# Altium schematic sheet LightSensorsButtons.SchDoc
size A
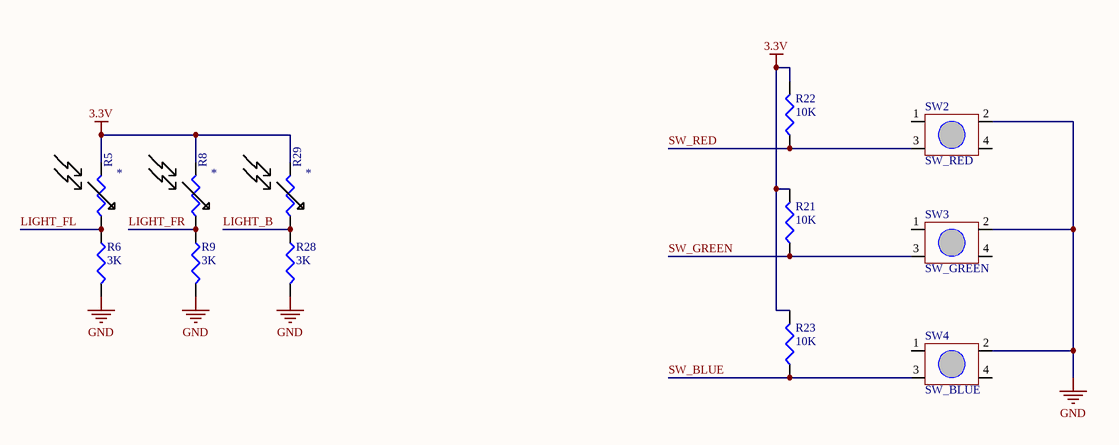
[diagram p0: LightSensorsButtons.SchDoc]

## Parts
R5  photoresistor  [photoresistor]  (value not drawn)
R6  value 3K  [RESC1608L]  (hidden comment: Res3)
R8  photoresistor  [photoresistor]  (value not drawn)
R9  value 3K  [RESC1608L]  (hidden comment: Res3)
R21  value 10K  [RESC1608L]  (hidden comment: Res3)
R22  value 10K  [RESC1608L]  (hidden comment: Res3)
R23  value 10K  [RESC1608L]  (hidden comment: Res3)
R28  value 3K  [RESC1608L]  (hidden comment: Res3)
R29  photoresistor  [photoresistor]  (value not drawn)
SW2  SW_RED  [SwitchTall-TL330]
SW3  SW_GREEN  [SwitchTall-TL330]
SW4  SW_BLUE  [SwitchTall-TL330]

## Nets
3.3V: R5.2 R8.2 R21.2 R22.2 R23.2 R29.2
GND: R6.2 R9.2 R28.2 SW2.2 SW3.2 SW4.2
LIGHT_B: R28.1 R29.1
LIGHT_FL: R5.1 R6.1
LIGHT_FR: R8.1 R9.1
SW_BLUE: R23.1 SW4.3
SW_GREEN: R21.1 SW3.3
SW_RED: R22.1 SW2.3

Not connected (* = marked no-connect by the designer): SW2 1 4; SW3 1 4; SW4 1 4

## Library data of the parts
R6 R9 R21-R23 R28 = Res3: Resistor; Published: 8-Jun-2000; LatestRevisionDate: 29-May-2009; LatestRevisionNote: IPC-7351 Footprint Added.; PackageReference: J1-0603; Publisher: Altium Limited; PackageDescription: Chip Resistor
SW2-SW4 = Switch-TL330
R5 R8 R29 = photoresistor: Value: *